# EAGLE design Volterra MKS Gen Daughter Board (EAGLE 9.1.3)
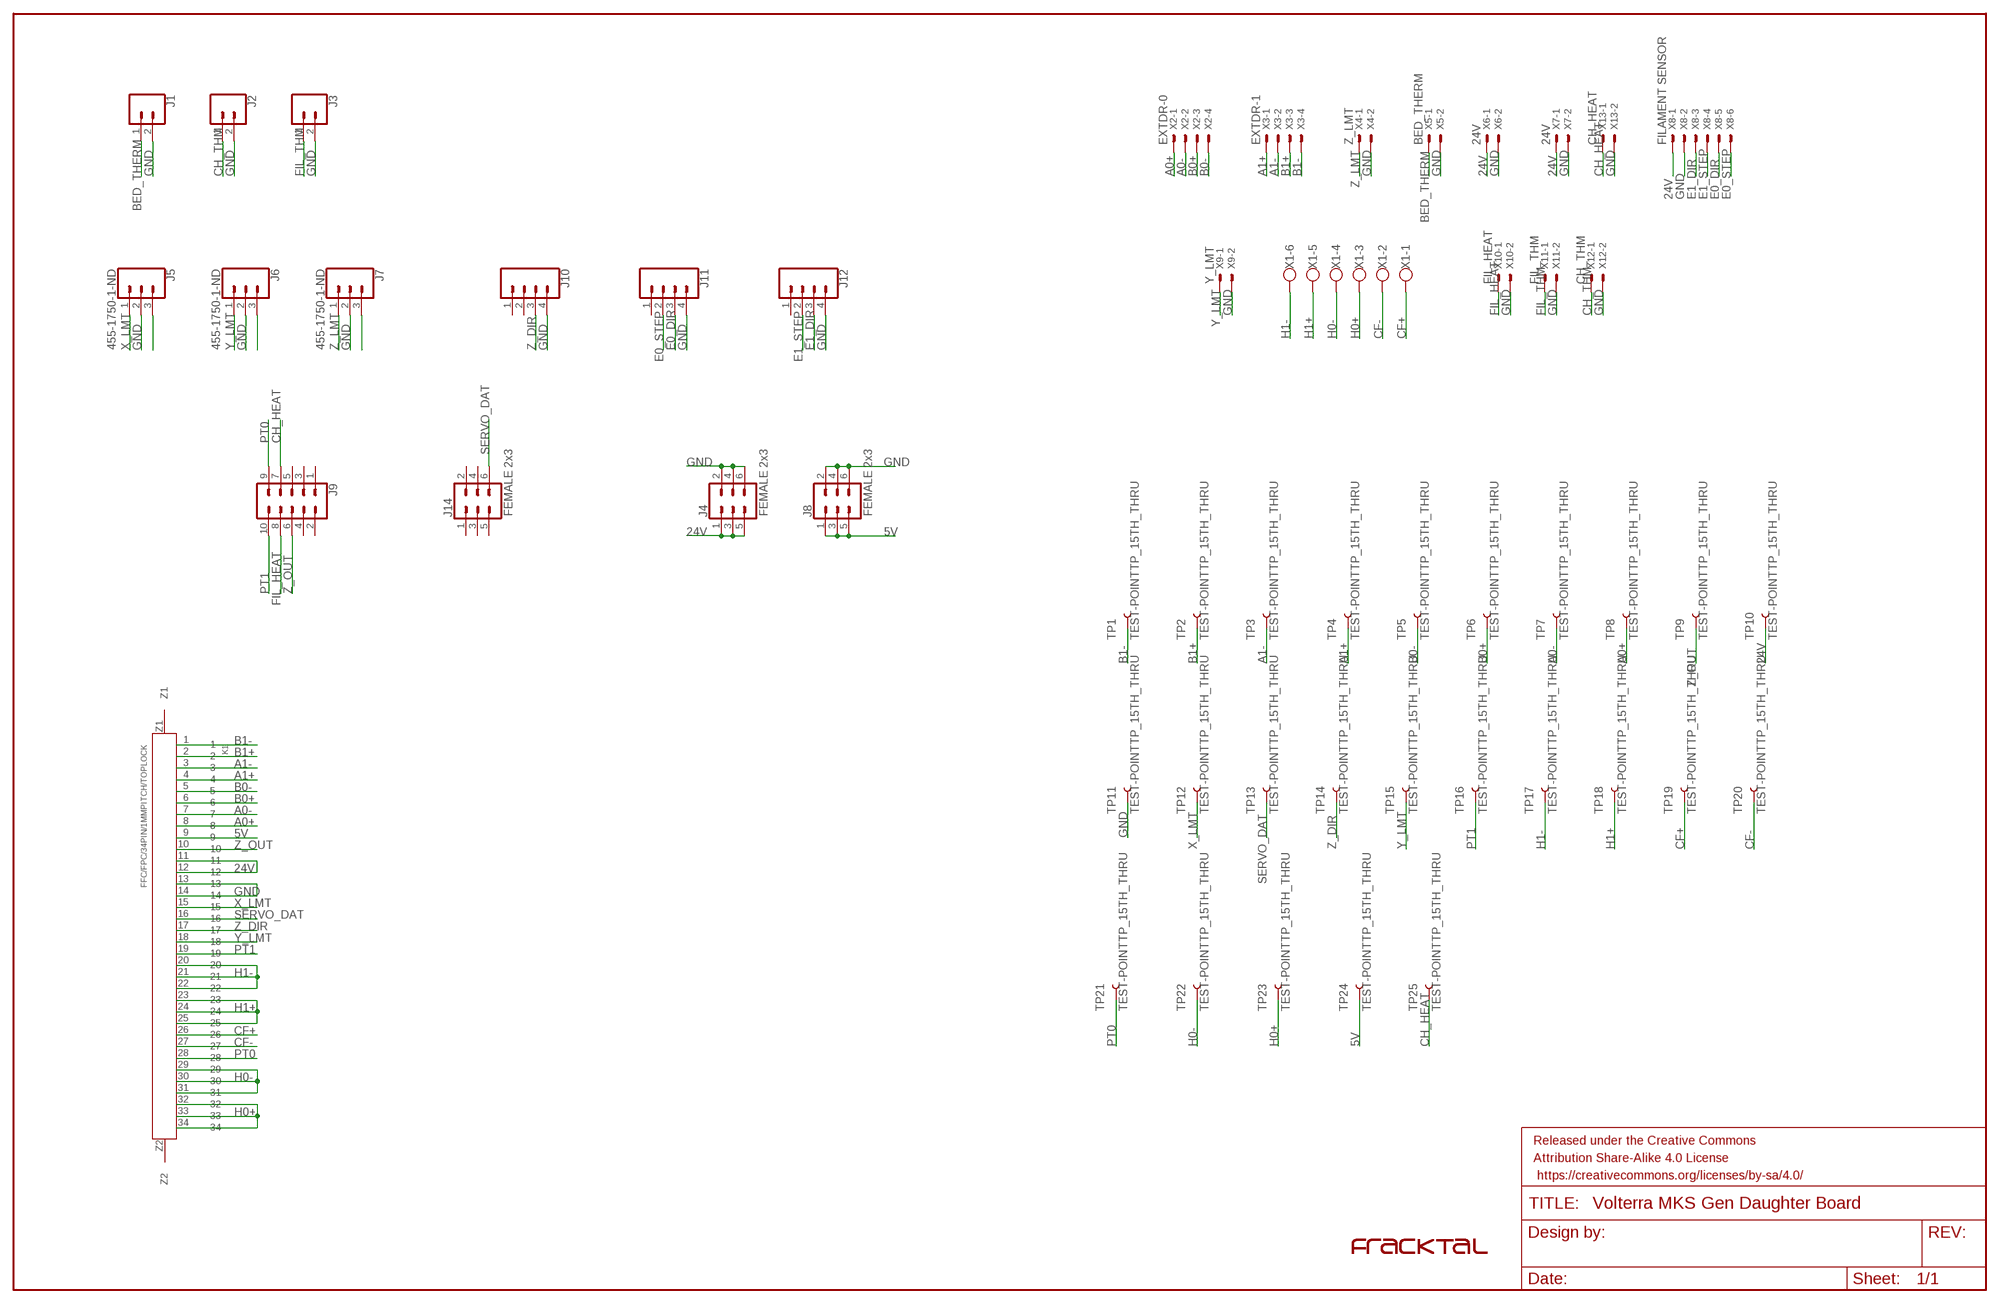
[diagram p0: schematic, sheet 1]

## Parts
FRAME1  FRAME-LEDGER  [CREATIVE_COMMONS]
J1  CONN_02  [1X02]
J2  CONN_02  [1X02]
J3  CONN_02  [1X02]
J4  FEMALE 2x3  CONN_03X2FEMALE  [2X3]
J5  455-1750-1-ND  CONN_03  [1X03]
J6  455-1750-1-ND  CONN_03  [1X03]
J7  455-1750-1-ND  CONN_03  [1X03]
J8  FEMALE 2x3  CONN_03X2FEMALE  [2X3]
J9  CONN_05X2PTH  [2X5]
J10  CONN_04  [1X04]
J11  CONN_04  [1X04]
J12  CONN_04  [1X04]
J14  FEMALE 2x3  CONN_03X2FEMALE  [2X3]
K1  FFC/FPC/34PIN/1MMPITCH/TOPLOCK  [34PIN/1MMPITCH/FFC/FPC]
TP1  TEST-POINTTP_15TH_THRU  [TP_15TH]
TP2  TEST-POINTTP_15TH_THRU  [TP_15TH]
TP3  TEST-POINTTP_15TH_THRU  [TP_15TH]
TP4  TEST-POINTTP_15TH_THRU  [TP_15TH]
TP5  TEST-POINTTP_15TH_THRU  [TP_15TH]
TP6  TEST-POINTTP_15TH_THRU  [TP_15TH]
TP7  TEST-POINTTP_15TH_THRU  [TP_15TH]
TP8  TEST-POINTTP_15TH_THRU  [TP_15TH]
TP9  TEST-POINTTP_15TH_THRU  [TP_15TH]
TP10  TEST-POINTTP_15TH_THRU  [TP_15TH]
TP11  TEST-POINTTP_15TH_THRU  [TP_15TH]
TP12  TEST-POINTTP_15TH_THRU  [TP_15TH]
TP13  TEST-POINTTP_15TH_THRU  [TP_15TH]
TP14  TEST-POINTTP_15TH_THRU  [TP_15TH]
TP15  TEST-POINTTP_15TH_THRU  [TP_15TH]
TP16  TEST-POINTTP_15TH_THRU  [TP_15TH]
TP17  TEST-POINTTP_15TH_THRU  [TP_15TH]
TP18  TEST-POINTTP_15TH_THRU  [TP_15TH]
TP19  TEST-POINTTP_15TH_THRU  [TP_15TH]
TP20  TEST-POINTTP_15TH_THRU  [TP_15TH]
TP21  TEST-POINTTP_15TH_THRU  [TP_15TH]
TP22  TEST-POINTTP_15TH_THRU  [TP_15TH]
TP23  TEST-POINTTP_15TH_THRU  [TP_15TH]
TP24  TEST-POINTTP_15TH_THRU  [TP_15TH]
TP25  TEST-POINTTP_15TH_THRU  [TP_15TH]
U$1  FRACKTALLOGO  [FRACKTALLOGO]
X1  W237-6  [W237-6]
X2  EXTDR-0  JST-XH-04-PIN-LONG-PAD  [JST-XH-04-PACKAGE-LONG-PAD]
X3  EXTDR-1  JST-XH-04-PIN-LONG-PAD  [JST-XH-04-PACKAGE-LONG-PAD]
X4  Z_LMT  JST-XH-02-PIN-LONG-PAD  [JST-XH-02-PACKAGE-LONG-PAD]
X5  BED_THERM  JST-XH-02-PIN-LONG-PAD  [JST-XH-02-PACKAGE-LONG-PAD]
X6  24V  JST-XH-02-PIN-LONG-PAD  [JST-XH-02-PACKAGE-LONG-PAD]
X7  24V  JST-XH-02-PIN-LONG-PAD  [JST-XH-02-PACKAGE-LONG-PAD]
X8  FILAMENT SENSOR  JST-XH-06-PIN-LONG-PAD  [JST-XH-06-PACKAGE-LONG-PAD]
X9  Y_LMT  JST-XH-02-PIN-LONG-PAD  [JST-XH-02-PACKAGE-LONG-PAD]
X10  FIL_HEAT  JST-XH-02-PIN-LONG-PAD  [JST-XH-02-PACKAGE-LONG-PAD]
X11  FIL_THM  JST-XH-02-PIN-LONG-PAD  [JST-XH-02-PACKAGE-LONG-PAD]
X12  CH_THM  JST-XH-02-PIN-LONG-PAD  [JST-XH-02-PACKAGE-LONG-PAD]
X13  CH_HEAT  JST-XH-02-PIN-LONG-PAD  [JST-XH-02-PACKAGE-LONG-PAD]

## Nets
5V: J8.1 J8.3 J8.5 K1.9 TP24.P$1
24V: J4.1 J4.3 J4.5 K1.11 K1.12 TP10.P$1 X6.1 X7.1 X8.1
A0+: K1.8 TP8.P$1 X2.1
A0-: K1.7 TP7.P$1 X2.2
A1+: K1.4 TP4.P$1 X3.1
A1-: K1.3 TP3.P$1 X3.2
B0+: K1.6 TP6.P$1 X2.3
B0-: K1.5 TP5.P$1 X2.4
B1+: K1.2 TP2.P$1 X3.3
B1-: K1.1 TP1.P$1 X3.4
BED_THERM: J1.1 X5.1
CF+: K1.26 TP19.P$1 X1.1
CF-: K1.27 TP20.P$1 X1.2
CH_HEAT: J9.7 TP25.P$1 X13.1
CH_THM: J2.1 X12.1
E0_DIR: J11.3 X8.5
E0_STEP: J11.2 X8.6
E1_DIR: J12.3 X8.3
E1_STEP: J12.2 X8.4
FIL_HEAT: J9.8 X10.1
FIL_THM: J3.1 X11.1
GND: J1.2 J2.2 J3.2 J4.2 J4.4 J4.6 J5.2 J6.2 J7.2 J8.2 J8.4 J8.6 J10.4 J11.4 J12.4 K1.13 K1.14 TP11.P$1 X4.2 X5.2 X6.2 X7.2 X8.2 X9.2 X10.2 X11.2 X12.2 X13.2
H0+: K1.32 K1.33 K1.34 TP23.P$1 X1.3
H0-: K1.29 K1.30 K1.31 TP22.P$1 X1.4
H1+: K1.23 K1.24 K1.25 TP18.P$1 X1.5
H1-: K1.20 K1.21 K1.22 TP17.P$1 X1.6
N$3: J5.3
N$6: J6.3
N$10: J7.3
PT0: J9.9 K1.28 TP21.P$1
PT1: J9.10 K1.19 TP16.P$1
SERVO_DAT: J14.6 K1.16 TP13.P$1
X_LMT: J5.1 K1.15 TP12.P$1
Y_LMT: J6.1 K1.18 TP15.P$1 X9.1
Z_DIR: J10.3 K1.17 TP14.P$1
Z_LMT: J7.1 X4.1
Z_OUT: J9.6 K1.10 TP9.P$1
Unconnected: J9.1 J9.2 J9.3 J9.4 J9.5 J10.1 J10.2 J11.1 J12.1 J14.1 J14.2 J14.3 J14.4 J14.5 K1.Z1 K1.Z2

## Library data of the parts
FRAME1 = SparkFun-Aesthetics:FRAME-LEDGER: Schematic Frame - Ledger Standard 11x14 US Ledger frame
J1-J3 = SparkFun-Connectors:CONN_02: Multi connection point. Often used as Generic Header-pin footprint for 0.1 inch spaced/style header connections On any of the 0.1 inch spaced packages, you can populate with these: Break Away Headers - Straight <https://www.sparkfun.com/products/116> (PRT-00116) Break Away Male Headers - Right Angle <https://www.sparkfun.com/products/553> (PRT-00553) Female Headers <https://www.sparkfun.com/products/115> (PRT-00115) Break Away Headers - Machine Pin <https://www.sparkfun.com/products/117> (PRT-00117) Break Away Female Headers - Swiss Machine Pin <https://www.sparkfun.com/products/743> (PRT-00743) For SCREWTERMINALS and SPRING TERMINALS visit here: Screw Terimnals on SparkFun.com <https://www.sparkfun.com/search/results?term=Screw+Terminals> (5mm/3.5mm/2.54mm spacing) This device is also useful as a general connection point to wire up your design to another part of your project. Our various solder wires solder well into these plated through hole pads. Hook-Up Wire - Assortment (Stranded, 22 AWG) <https://www.sparkfun.com/products/11375> (PRT-11375) Hook-Up Wire - Assortment (Solid Core, 22 AWG) <https://www.sparkfun.com/products/11367> (PRT-11367) View the entire wire category on our website here <https://www.sparkfun.com/categories/141> Special notes: Molex polarized connector foot print use with: PRT-08233 with associated crimp pins and housings. 2.54_SCREWTERM for use with PRT-10571. 3.5mm Screw Terminal footprints for PRT-08084 5mm Screw Terminal footprints for use with PRT-08432
J4 J8 J14 = SparkFun-Connectors:CONN_03X2: Multi connection point. Often used as Generic Header-pin footprint for 0.1 inch spaced/style header connections You can populate with any combo of single row headers, but if you'd like an exact match, check these: Header - 2x3 (Male, 0.1") <https://www.sparkfun.com/products/12807> (PRT-12807) Header - 2x3 (Female, 0.1") <https://www.sparkfun.com/products/13010> (PRT-13010) 2x3 Pin Shrouded Header <https://www.sparkfun.com/products/10877> (PRT-10877) On any of the 0.1 inch spaced packages, you can populate with these: Break Away Headers - Straight <https://www.sparkfun.com/products/116> (PRT-00116) Break Away Male Headers - Right Angle <https://www.sparkfun.com/products/553> (PRT-00553) Female Headers <https://www.sparkfun.com/products/115> (PRT-00115) Break Away Headers - Machine Pin <https://www.sparkfun.com/products/117> (PRT-00117) Break Away Female Headers - Swiss Machine Pin <https://www.sparkfun.com/products/743> (PRT-00743) Special note: the shrouded connector mates well with our 3x2 ribbon cables: Ribbon Crimp Connector - 6-pin (2x3, Female) <https://www.sparkfun.com/products/10651> (PRT-10651) Ribbon Cable - 6 wire (15ft) <https://www.sparkfun.com/products/10646> (PRT-10646); PROD_ID: CONN-11566
J5-J7 = SparkFun-Connectors:CONN_03: Multi connection point. Often used as Generic Header-pin footprint for 0.1 inch spaced/style header connections On any of the 0.1 inch spaced packages, you can populate with these: Break Away Headers - Straight <https://www.sparkfun.com/products/116> (PRT-00116) Break Away Male Headers - Right Angle <https://www.sparkfun.com/products/553> (PRT-00553) Female Headers <https://www.sparkfun.com/products/115> (PRT-00115) Break Away Headers - Machine Pin <https://www.sparkfun.com/products/117> (PRT-00117) Break Away Female Headers - Swiss Machine Pin <https://www.sparkfun.com/products/743> (PRT-00743) Stackable Header - 3 Pin (Female, 0.1") <https://www.sparkfun.com/products/13875> (PRT-13875) For SCREWTERMINALS and SPRING TERMINALS visit here: Screw Terimnals on SparkFun.com <https://www.sparkfun.com/search/results?term=Screw+Terminals> (5mm/3.5mm/2.54mm spacing) This device is also useful as a general connection point to wire up your design to another part of your project. Our various solder wires solder well into these plated through hole pads. Hook-Up Wire - Assortment (Stranded, 22 AWG) <https://www.sparkfun.com/products/11375> (PRT-11375) Hook-Up Wire - Assortment (Solid Core, 22 AWG) <https://www.sparkfun.com/products/11367> (PRT-11367) View the entire wire category on our website here <https://www.sparkfun.com/categories/141> Special notes: Molex polarized connector foot print use with SKU : PRT-08232 with associated crimp pins and housings.; PROD_ID: XXX-00000
J9 = SparkFun-Connectors:CONN_05X2: Multi connection point. Often used as Generic Header-pin footprint for 0.1 inch spaced/style header connections For AVR SPI programming port, see special device with nice symbol: "AVR_SPI_PROG_5x2.dev" You can populate with any combo of single row headers, but if you'd like an exact match, check these: 2x5 AVR ICSP Male Header <https://www.sparkfun.com/products/778> (PRT-00778) 2x5 Pin Shrouded Header <https://www.sparkfun.com/products/8506> (PRT-08506) On any of the 0.1 inch spaced packages, you can populate with these: Break Away Headers - Straight <https://www.sparkfun.com/products/116> (PRT-00116) Break Away Male Headers - Right Angle <https://www.sparkfun.com/products/553> (PRT-00553) Female Headers <https://www.sparkfun.com/products/115> (PRT-00115) Break Away Headers - Machine Pin <https://www.sparkfun.com/products/117> (PRT-00117) Break Away Female Headers - Swiss Machine Pin <https://www.sparkfun.com/products/743> (PRT-00743) Special note: the shrouded connector mates well with our 5x2 ribbon cables: 2x5 Pin IDC Ribbon Cable <https://www.sparkfun.com/products/8535> (PRT-08535); PROD_ID: CONN-08499; SF_ID: PRT-0778
J10-J12 = SparkFun-Connectors:CONN_04: Multi connection point. Often used as Generic Header-pin footprint for 0.1 inch spaced/style header connections On any of the 0.1 inch spaced packages, you can populate with these: Break Away Headers - Straight <https://www.sparkfun.com/products/116> (PRT-00116) Break Away Male Headers - Right Angle <https://www.sparkfun.com/products/553> (PRT-00553) Female Headers <https://www.sparkfun.com/products/115> (PRT-00115) Break Away Headers - Machine Pin <https://www.sparkfun.com/products/117> (PRT-00117) Break Away Female Headers - Swiss Machine Pin <https://www.sparkfun.com/products/743> (PRT-00743) For SCREWTERMINALS and SPRING TERMINALS visit here: Screw Terimnals on SparkFun.com <https://www.sparkfun.com/search/results?term=Screw+Terminals> (5mm/3.5mm/2.54mm spacing) This device is also useful as a general connection point to wire up your design to another part of your project. Our various solder wires solder well into these plated through hole pads. Hook-Up Wire - Assortment (Stranded, 22 AWG) <https://www.sparkfun.com/products/11375> (PRT-11375) Hook-Up Wire - Assortment (Solid Core, 22 AWG) <https://www.sparkfun.com/products/11367> (PRT-11367) View the entire wire category on our website here <https://www.sparkfun.com/categories/141> Special notes: Molex polarized connector foot print use with SKU : PRT-08231 with associated crimp pins and housings. 1MM SMD Version SKU: PRT-10208; PROD_ID: CONN-09696
K1 = FracktalWorks_Eagle_Library:FFC/FPC/34PIN/1MMPITCH/TOPLOCK
TP1-TP25 = SparkFun-Connectors:TEST-POINT: SparkFun Test Points Bare copper test points for troubleshooting or In-Circuit-Testing. These are used by our Production team for verifying production board runs using pogo-pins on test beds. SparkFun Products: SparkFun LSM9DS1 Breakout <https://www.sparkfun.com/products/13284> SparkFun PSOC <https://www.sparkfun.com/products/13714> SparkFun Load Cell Amplifier <https://www.sparkfun.com/products/13879>
U$1 = FracktalWorks_Eagle_Library:FRACKTALLOGO
X1 = con-wago-500:W237-6: WAGO SCREW CLAMP; OC_FARNELL: unknown; OC_NEWARK: unknown
X2 X3 = Rembrandt Electronics - JST XH Connectors v1-0:JST-XH-04-PIN: JST XH Connector 2 Pin Wire to board connector. Pitch: 2,54 mm, (0.100") Number of pins: 4 Created by Rembrandt Electronics www.rembrandtelectronics.com
X4-X7 X9-X13 = Rembrandt Electronics - JST XH Connectors v1-0:JST-XH-02-PIN: JST XH Connector 2 Pin Wire to board connector. Pitch: 2,54 mm, (0.100") Number of pins: 2 Created by Rembrandt Electronics www.rembrandtelectronics.com
X8 = Rembrandt Electronics - JST XH Connectors v1-0:JST-XH-06-PIN: JST XH Connector 2 Pin Wire to board connector. Pitch: 2,54 mm, (0.100") Number of pins: 6 Created by Rembrandt Electronics www.rembrandtelectronics.com

## Net classes
0 default: width 0.305 mm

## Board
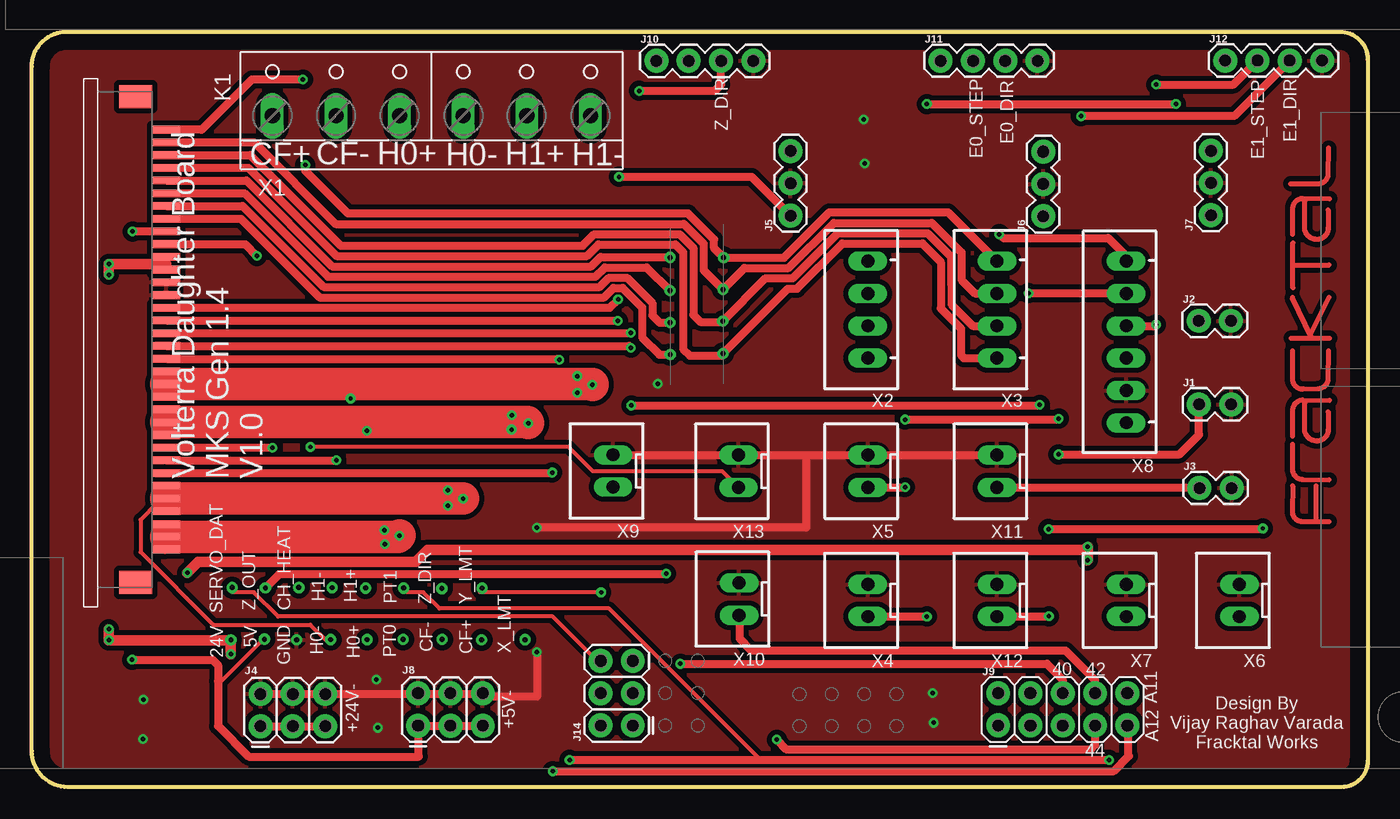
[diagram p1: board, top side]
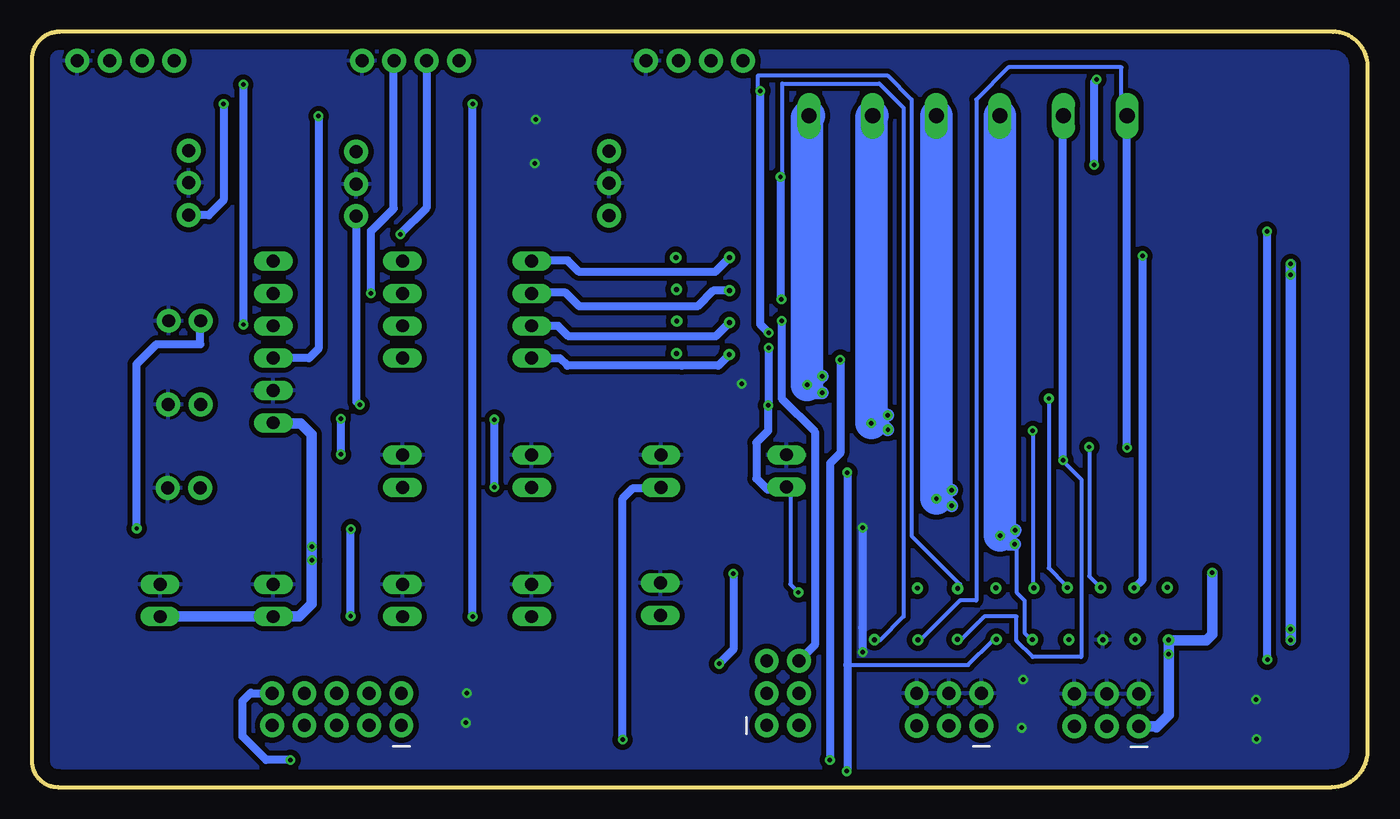
[diagram p2: board, bottom side, seen from below]

Size 104.99 x 59.37 mm. Coordinates in mm from the lower left corner, seen from the top.
Outline: 0,56.65 arc-90 2.72,59.37 102.82,59.37 arc-90 104.99,57.2 104.99,2.06 arc-90 102.93,0 2.82,0 arc-90 0,2.84 0,56.65
Copper layers (1*16): Top 0.035mm / dielectric 1.5mm / Bottom 0.035mm
Design rules "LionCircuits": minimum track width 8mil, minimum drill 0.35mm, track to track 8mil, track to pad 8mil, pad to pad 8mil, via to via 8mil, smd to smd 8mil, copper to edge 50mil, drill to drill 10mil, minimum pad ring 10mil, minimum via ring 8mil, stop-mask expansion 4mil, vias tented up to drill 0mil, thermal gap 10mil

### Footprints (pad centres in the part's own frame; a part is rotated, then mirrored left to right if it is on the bottom)
1X02 = drill 1.016 pad 1.88: 1 0,0; 2 2.54,0
2X3 = drill 1.016 pad 1.88: 1 0,0; 2 0,2.54; 3 2.54,0; 4 2.54,2.54; 5 5.08,0; 6 5.08,2.54
1X03 = drill 1.016 pad 1.88: 1 0,0; 2 2.54,0; 3 5.08,0
2X5 = drill 1.016 pad 1.88: 1 0,0; 2 0,2.54; 3 2.54,0; 4 2.54,2.54; 5 5.08,0; 6 5.08,2.54; 7 7.62,0; 8 7.62,2.54; 9 10.16,0; 10 10.16,2.54
1X04 = drill 1.016 pad 1.88: 1 0,0; 2 2.54,0; 3 5.08,0; 4 7.62,0
34PIN/1MMPITCH/FFC/FPC = smd 0.6 x 2.2: 1 -14.43,2.1; 2 -13.43,2.1; 3 -12.43,2.1; 4 -11.43,2.1; 5 -10.43,2.1; 6 -9.43,2.1; 7 -8.43,2.1; 8 -7.43,2.1; 9 -6.43,2.1; 10 -5.43,2.1; 11 -4.43,2.1; 12 -3.43,2.1; 13 -2.43,2.1; 14 -1.43,2.1; 15 -0.43,2.1; 16 0.57,2.1; 17 1.57,2.1; 18 2.57,2.1; 19 3.57,2.1; 20 4.57,2.1; 21 5.57,2.1; 22 6.57,2.1; 23 7.57,2.1; 24 8.57,2.1; 25 9.57,2.1; 26 10.57,2.1; 27 11.57,2.1; 28 12.57,2.1; 29 13.57,2.1; 30 14.57,2.1; 31 15.57,2.1; 32 16.57,2.1; 33 17.57,2.1; 34 18.57,2.1 | smd 1.8 x 2.6: Z1 -17.03,-0.3; Z2 21.17,-0.3
TP_15TH = drill 0.381 pad 0.61: P$1 0,0
W237-6 = drill 1.194 long: 1 -12.5,-1.27; 2 -7.5,-1.27; 3 -2.5,-1.27; 4 2.5,-1.27; 5 7.5,-1.27; 6 12.5,-1.27
JST-XH-04-PACKAGE-LONG-PAD = drill 1.016 long: 1 -3.81,0; 2 -1.27,0; 3 1.27,0; 4 3.81,0
JST-XH-02-PACKAGE-LONG-PAD = drill 1.016 long: 1 -1.27,0; 2 1.27,0
JST-XH-06-PACKAGE-LONG-PAD = drill 1.016 long: 1 -6.35,0; 2 -3.81,0; 3 -1.27,0; 4 1.27,0; 5 3.81,0; 6 6.35,0

### Placement (x,y rotation side)
FRAME1  22.75,-8.09 0 top  (outside the outline)
J1  91.72,30.09 0 top
J2  91.71,36.65 0 top
J3  91.77,23.51 0 top
J4  17.97,4.79 0 top
J5  59.63,44.92 90 top
J6  79.49,44.87 90 top
J7  92.66,44.96 90 top
J8  30.37,4.83 0 top
J9  75.95,4.84 0 top
J10  49.09,57.09 0 top
J11  71.42,57.1 0 top
J12  93.79,57.11 0 top
J14  47.23,4.84 90 top
K1  8.47,37.25 270 top
TP1  54.37,41.62 90 top
TP2  54.32,39.12 90 top
TP3  54.31,36.63 90 top
TP4  54.32,34.07 90 top
TP5  50.15,41.63 90 top
TP6  50.15,39.03 90 top
TP7  50.16,36.51 90 top
TP8  50.18,34 90 top
TP9  18.36,15.66 0 top
TP10  15.65,11.57 0 top
TP11  20.82,11.57 0 top
TP12  38.76,11.58 0 top
TP13  15.75,15.68 0 top
TP14  32.22,15.61 0 top
TP15  35.38,15.63 0 top
TP16  29.22,15.65 0 top
TP17  23.61,15.67 0 top
TP18  26.24,15.65 0 top
TP19  35.34,11.57 0 top
TP20  32.25,11.61 0 top
TP21  29.18,11.61 0 top
TP22  23.48,11.6 0 top
TP23  26.35,11.6 0 top
TP24  18.28,11.62 0 top
TP25  20.98,15.68 0 top
U$1  102.07,32.87 90 top
X1  31.41,54.04 0 top
X2  65.7,37.53 90 top
X3  75.86,37.53 90 top
X4  65.7,14.67 90 top
X5  65.7,24.83 90 top
X6  94.91,14.67 90 top
X7  86.02,14.67 90 top
X8  86.02,34.99 90 top
X9  45.68,24.85 90 top
X10  55.59,14.78 90 top
X11  75.86,24.83 90 top
X12  75.86,14.67 90 top
X13  55.54,24.83 90 top

### Tracks (layer width: path | path; a pad name or v marks a point on that pad's centre or on a via)
5V  (via drill 0.35)
  Top 0.305: TP24.P$1 18.07,11.49 14.9,8.32 14.64,8.32
  Top 0.61: K1.9 v7.92,43.68 v7.91,43.68 | J8.5 J8.3 J8.1 30.4,4.79 30.4,2.39 17.06,2.39 14.64,4.8 14.64,8.32 14.64,9.58 14.21,10.01 v7.89,10.01
  Bottom 0.61: v7.91,43.68 7.91,10.03 v7.89,10.01
24V  (via drill 0.35)
  Top 0.61: K1.11 10.57,41.11 K1.12 | J4.1 J4.3 J4.5
  Top 0.813: 10.57,41.11 6.07,41.11 v6.06,41.12 v6.06,40.28 | v6.06,12.41 v6.06,11.54 15.62,11.54 TP10.P$1 v15.65,10.44 | v12.22,16.84 13.09,17.71 30.16,17.71 31.09,18.64 82.74,18.64 v82.98,18.88 82.98,17.84 v82.97,17.83
  Bottom 0.813: v6.06,41.12 v6.06,11.54 | J4.1 16.68,4.79 16.6,4.71 15.65,5.66 v15.65,10.44 TP10.P$1 15.6,11.52 12.69,11.52 12.22,11.99 v12.22,16.84 | X6.1 X7.1 83.97,13.4 82.98,14.39 v82.98,18.88 82.98,27.71 83.86,28.59 85.97,28.59 X8.1
A0+
  Top 0.61: K1.8 16.42,44.68 22.61,38.49 44.98,38.49 45.71,39.23 46.44,39.23 47.97,37.71 47.97,35.35 49.31,34 TP8.P$1
  Bottom 0.61: TP8.P$1 51.04,33.13 53.91,33.13 53.92,33.12 62.9,33.12 63.49,33.71 65.68,33.71 X2.1
A0-
  Top 0.61: K1.7 16.57,45.68 22.94,39.31 44.64,39.31 45.37,40.04 46.78,40.04 48.78,38.04 48.78,37.07 49.34,36.51 TP7.P$1
  Bottom 0.61: TP7.P$1 51.26,35.42 62.79,35.42 63.63,36.26 X2.2
A1+
  Top 0.61: K1.4 17.02,48.68 23.95,41.74 43.63,41.74 44.53,42.65 50.57,42.65 51.18,42.04 51.18,34.44 51.71,33.91 54.15,33.91 TP4.P$1 59.42,39.18 60.15,39.18 63.7,42.72 70,42.72 71.44,41.29 71.44,37.62 73.03,36.04 73.03,33.95 73.25,33.72 X3.1
A1-
  Top 0.61: K1.3 17.17,49.68 24.29,42.56 43.29,42.56 44.19,43.46 50.91,43.46 51.99,42.38 51.99,37.11 52.54,36.56 54.24,36.56 TP3.P$1 57.67,39.99 59.82,39.99 63.36,43.54 70.4,43.54 72.25,41.69 72.25,39.53 72.28,39.5 72.28,37.93 73.95,36.26 X3.2
B0+
  Top 0.61: K1.6 16.72,46.68 23.28,40.12 44.3,40.12 45.04,40.85 48.33,40.85 TP6.P$1
  Bottom 0.61: TP6.P$1 51.44,39.03 52.68,37.78 61.95,37.78 63.03,38.86 65.63,38.86 X2.3
B0-
  Top 0.61: K1.5 16.87,47.68 23.62,40.93 43.97,40.93 44.7,41.67 50.12,41.67 TP5.P$1
  Bottom 0.61: TP5.P$1 51.28,40.5 61.98,40.5 62.88,41.4 65.63,41.4 X2.4
B1+
  Top 0.61: K1.2 17.47,50.68 23.88,44.27 51.25,44.27 52.81,42.71 52.81,40.63 TP2.P$1 56.01,40.81 59.48,40.81 63.02,44.35 70.74,44.35 73.06,42.02 73.06,39.87 74.13,38.8 X3.3
B1-  (via drill 0.35)
  Top 0.61: v21.49,48.89 21.49,48.46 24.86,45.08 51.58,45.08 53.62,43.05 53.62,42.37 TP1.P$1 59.12,41.62 62.69,45.19 72.01,45.19 X3.4 | v21.31,55.63 17.3,55.63 13.34,51.66 10.59,51.66 K1.1
  Bottom 0.61: v21.49,48.89 21.49,55.45 v21.31,55.63
BED_THERM  (via drill 0.35)
  Top 0.61: X5.1 v68.62,23.56 v68.63,23.57 | v68.63,28.89 80.65,28.89 v80.71,28.96 | v80.7,26.15 90.2,26.15 91.75,27.7 91.72,27.72 J1.1
  Bottom 0.61: v68.63,23.57 v68.63,28.89 | v80.71,28.96 80.71,26.16 v80.7,26.15
CF+  (via drill 0.35)
  Top 0.61: K1.26 v18.91,26.68
  Bottom 0.305: TP19.P$1 35.22,11.49 32.04,14.67 30.77,14.67 30.77,54.04 28.23,56.58 19.34,56.58 19.34,52.77 X1.1
  Bottom 0.61: v18.91,26.68 X1.1
CF-  (via drill 0.35)
  Top 0.61: K1.27 23.9,25.68 v23.93,25.7
  Bottom 0.305: TP20.P$1 32.04,11.49 30.14,13.4 27.6,13.4 27.6,11.49 26.33,10.22 22.52,10.22 22.52,24.19 23.79,25.46 v23.93,25.7
  Bottom 0.61: X1.2 23.94,52.74 23.94,25.72 v23.93,25.7
CH_HEAT  (via drill 0.35)
  Top 0.305: v21.88,26.73 42.2,26.73 44.11,24.83 54.27,24.83 X13.1
  Top 0.61: J9.7 83.57,3.31 83.2,2.95 59.32,2.95 v58.55,3.72
  Bottom 0.305: v21.88,26.73 21.88,16.57 21.25,15.94 TP25.P$1
  Bottom 0.61: v58.55,3.72 58.55,22.67 57.72,23.5 55.17,23.5 55.23,23.56 X13.1
CH_THM  (via drill 0.35)
  Top 0.61: X12.1 79.91,13.4 v79.93,13.42 | v79.91,20.28 96.7,20.28 v96.75,20.33
  Bottom 0.61: v79.93,13.42 79.93,20.26 v79.91,20.28 | v96.75,20.33 96.75,33.25 95.19,34.81 91.75,34.81 91.75,36.61 J2.1
E0_DIR  (via drill 0.35)
  Top 0.61: X8.5 78.36,38.8 v78.33,38.82
  Bottom 0.61: v78.33,38.82 78.33,43.71 76.56,45.49 76.56,57.05 J11.3
E0_STEP  (via drill 0.35)
  Top 0.61: v76.04,43.46 76.34,43.15 84.6,43.15 86.02,41.73 X8.6
  Bottom 0.61: J11.2 73.97,45.53 v76.04,43.46
E1_DIR  (via drill 0.35)
  Top 0.61: J12.3 94.5,52.74 v82.46,52.74
  Bottom 0.61: v82.46,52.74 82.46,34.47 83.21,33.72 X8.3
E1_STEP  (via drill 0.35)
  Top 0.61: X8.4 88.25,36.26 v88.35,36.36 | v88.37,55.22 94.44,55.22 J12.2
  Bottom 0.61: v88.35,36.36 88.35,55.21 v88.37,55.22
FIL_HEAT
  Top 0.61: J9.8 83.57,8.42 81.27,10.72 56.58,10.72 55.64,11.66 55.64,13.46 X10.1
FIL_THM
  Top 0.61: X11.1 91.72,23.56 J3.1
GND  (via drill 0.35)
  Top 0.61: J4.2 J4.6 35.45,7.33 | 35.45,7.33 J8.6 | X9.2 55.54,26.12 X13.2 60.85,26.1 | 60.85,26.1 X5.2 X11.2 | 60.85,26.1 60.85,20.4 v39.7,20.4 | v39.7,10.62 39.7,7.1 35.45,7.1 35.45,7.33
  Bottom 0.61: v39.7,20.4 39.7,12.53 39.71,12.53 39.71,10.63 v39.7,10.63 v39.7,10.62
  other vias: 8.76,6.88 8.72,3.78 27.08,8.46 27.19,4.66 70.82,7.38 70.87,5.05 49.2,31.71 65.37,52.49 65.46,49.03
  pour Bottom (isolate 0.406): -0.01,59.49 105.24,59.49 105.24,-0.18 -0.01,-0.18
  pour Top (isolate 0.406): -0.03,59.51 105.26,59.51 105.26,-0.19 -0.03,-0.19
H0+  (via drill 0.35)
  Top 0.305: K1.34 10.45,18.48 K1.33 10.45,20.38 K1.32
  Top 2.54: K1.33 28.8,19.68 v28.89,19.77
  Bottom 0.305: TP23.P$1 26.33,11.49 26.96,12.13 26.96,14.67 27.6,15.3 27.6,19.11 v27.74,19.1
  Bottom 1.016: v27.7,20.18 28.11,19.77 v28.89,19.77 28.22,19.1 v27.74,19.1
  Bottom 2.54: v28.89,19.77 28.89,52.75 X1.3
H0-  (via drill 0.35)
  Top 0.305: TP22.P$1 23.15,11.49 21.88,12.76 14.26,12.76 8.55,18.48 8.55,21.02 9.82,22.29 K1.30 | K1.31 10.45,21.65 K1.30 | K1.29 10.45,23.56 K1.30
  Top 2.54: K1.30 33.89,22.68 v33.9,22.67
  Bottom 1.016: v32.7,23.34 33.25,23.34 33.91,22.68 | v33.9,22.67 33.24,22.67 v32.69,22.12
  Bottom 2.54: v33.9,22.67 33.91,22.68 X1.4
H1+  (via drill 0.35)
  Top 0.305: v26.33,28 26.33,28.68
  Top 0.61: K1.25 K1.24 K1.23
  Top 2.54: K1.24 26.33,28.68 38.95,28.68 v39.01,28.61
  Bottom 0.305: v26.33,28 26.33,15.94 TP18.P$1
  Bottom 1.016: v37.72,29.24 38.39,29.24 v39.01,28.61 38.21,28.61 v37.71,28.11
  Bottom 2.54: v39.01,28.61 39.01,52.66 X1.5
H1-  (via drill 0.35)
  Top 0.305: v25.06,30.54 25.06,31.68 | K1.22 10.45,30.54 K1.21 10.45,32.45 K1.20
  Top 0.61: K1.22 K1.21
  Top 2.54: K1.21 25.06,31.68 44.06,31.68 v44.06,31.62
  Bottom 0.305: v25.06,30.54 25.06,17.21 23.79,15.94 TP17.P$1
  Bottom 1.016: v42.86,32.31 43.55,31.62 v44.06,31.62 43.43,31 v42.86,31
  Bottom 2.54: X1.6 44.07,52.61 44.07,31.64 v44.06,31.62
PT0  (via drill 0.35)
  Top 0.61: K1.28 40.85,24.68 v40.89,24.73 | v40.95,1.24 85.04,1.24 86.23,2.44 86.2,2.48 86.2,4.75 J9.9
  Bottom 0.305: 40.89,9.59 31.41,9.59 29.5,11.49 TP21.P$1
  Bottom 0.61: v40.89,24.73 40.89,9.59 40.89,1.3 v40.95,1.24
PT1  (via drill 0.35)
  Top 0.305: TP16.P$1 29.5,15.3 30.77,15.3 32.04,14.03 45.38,14.03 57.44,1.97 57.44,2.13
  Top 0.61: v42.27,2.13 57.44,2.13 v84.66,2.13 | K1.19 10.58,33.67 41.38,33.67 v41.45,33.59
  Bottom 0.61: v84.66,2.13 86.59,2.13 88.43,3.98 88.43,6.77 87.78,7.42 87.74,7.38 J9.10 | v42.27,2.13 42.25,2.13 42.25,25.44 41.44,26.25 41.44,33.44 41.45,33.45 v41.45,33.59
SERVO_DAT  (via drill 0.35)
  Top 0.305: J14.6 44.11,10.22 40.93,13.4 19.34,13.4 17.44,15.3 15.76,15.3 15.76,15.68 TP13.P$1
  Top 0.61: K1.16 46.04,36.68 v46.06,36.65
  Bottom 0.61: J14.6 43.45,11.16 43.45,27.94 46.06,30.56 v46.06,36.65
X_LMT  (via drill 0.35)
  Top 0.61: K1.15 45.41,37.68 v46.08,38.34 | v46.15,47.98 56.57,47.98 J5.1
  Bottom 0.305: TP12.P$1 38.39,11.49 36.49,13.4 36.49,53.4 38.39,55.31 46.01,55.31 46.01,48.32 v46.15,47.98
  Bottom 0.61: v46.15,47.98 46.1,47.93 46.1,38.33 46.09,38.34 v46.08,38.34
Y_LMT  (via drill 0.35)
  Top 0.305: v44.74,15.3 35.22,15.3 TP15.P$1
  Top 0.61: K1.18 46.94,34.68 v47.08,34.54 | v47.12,30 79.16,30 v79.21,30.05
  Bottom 0.305: v44.74,15.3 45.38,15.94 45.38,23.56 X9.1
  Bottom 0.61: v47.08,34.54 47.1,34.52 47.1,30.01 v47.12,30 47.12,28 48.04,27.08 48.04,24.26 47.17,23.38 46.96,23.58 X9.1 | v79.21,30.05 79.46,30.3 79.46,44.84 J6.1
Z_DIR  (via drill 0.35)
  Top 0.61: K1.17 47.05,35.68 v47.08,35.71 | v47.74,54.74 53.68,54.74 54.17,55.22 J10.3
  Bottom 0.305: TP14.P$1 32.04,15.94 35.85,19.75 35.85,54.04 37.76,55.94 47.92,55.94 47.92,54.67 v47.74,54.74
  Bottom 0.61: v47.08,35.71 47.74,36.37 v47.74,54.74
Z_LMT  (via drill 0.35)
  Top 0.61: X4.1 70.33,13.4 v70.35,13.41 | v70.35,53.7 v89.92,53.7
  Bottom 0.61: v70.35,13.41 v70.35,53.7 | v89.92,53.7 89.92,46.13 91.08,44.96 J7.1
Z_OUT  (via drill 0.35)
  Top 0.61: K1.10 16.77,42.68 v17.69,41.76 | v49.86,16.78 49.81,16.73 19.43,16.73 TP9.P$1 | v50.98,9.69 79.78,9.69 81.03,8.45 J9.6
  Bottom 0.61: v17.69,41.76 17.69,16.29 17.73,16.29 TP9.P$1 | v49.86,16.78 49.86,10.81 v50.98,9.69

### Text on the board
tNames: Z_DIR | E1_DIR | E0_DIR | CF+ | CF- | H0+ | H0- | H1+ | H1- | E0_STEP | E1_STEP | Volterra Daughter Board / MKS Gen 1.4 / V1.0 | SERVO_DAT | Z_OUT | CH_HEAT | H1- | H1+ | PT1 | Z_DIR | Y_LMT | 5V | 24V | H0- | H0+ | PT0 | CF- | CF+ | X_LMT | 42 | GND | 40 | A11 | Design By / Vijay Raghav Varada / Fracktal Works | +24V- | +5V- | 44 | A12